# Altium schematic sheet HIGH_CURR_MOS2.SchDoc
size A4; SheetNumber: 6; SheetTotal: 14
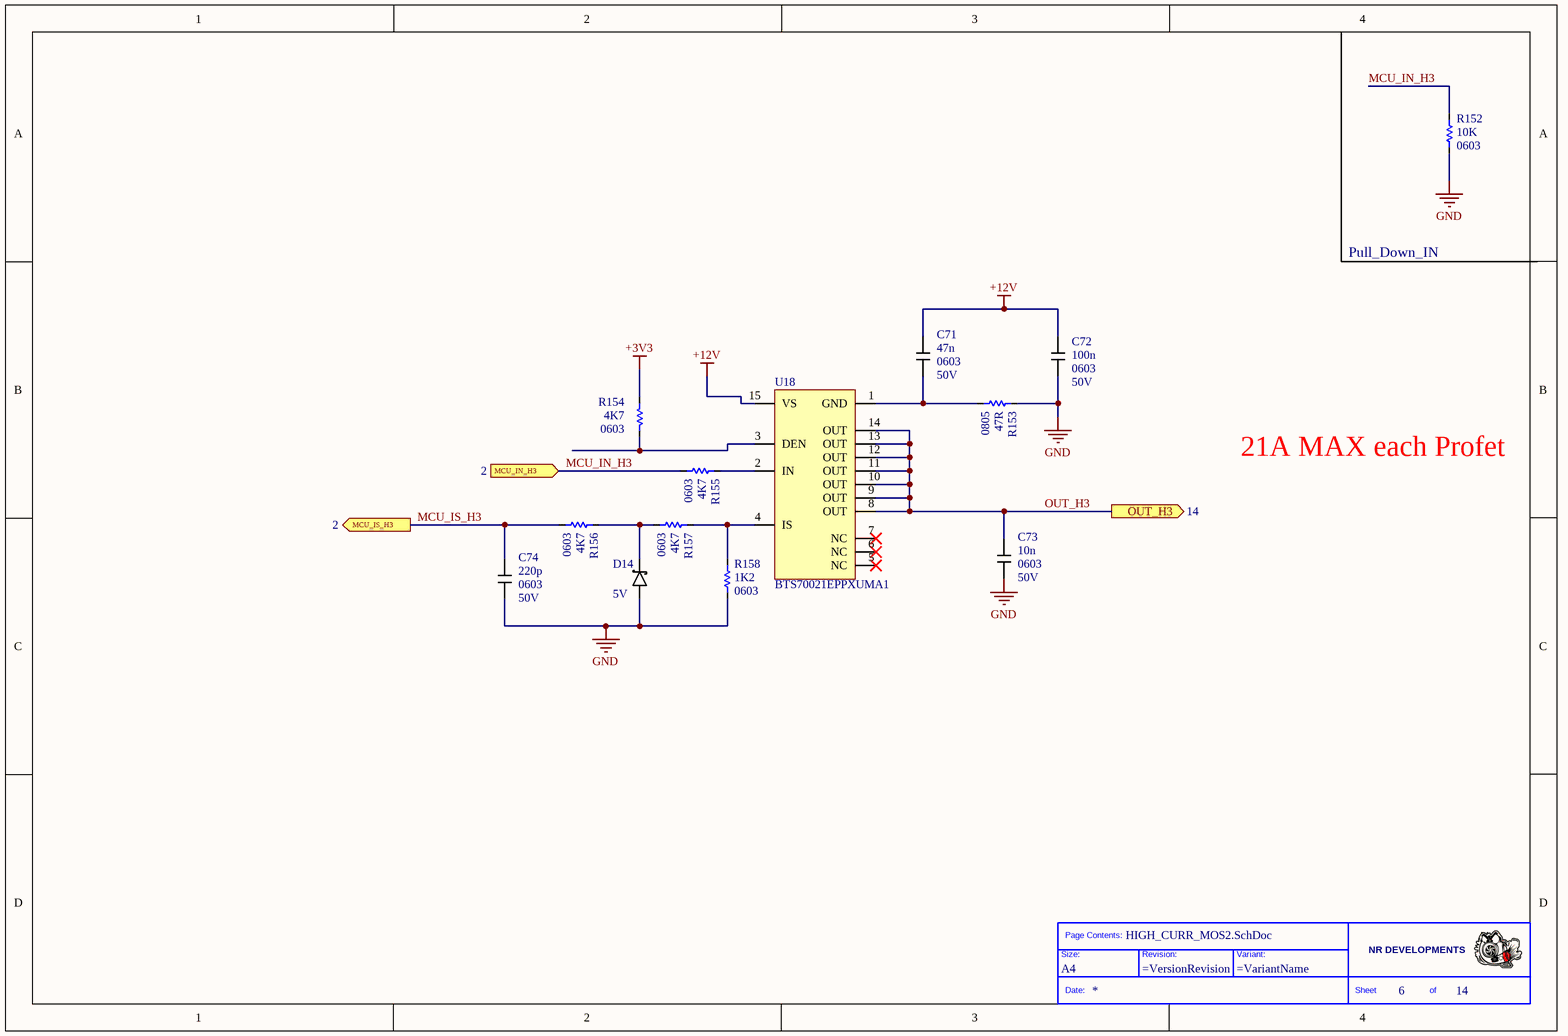
[diagram p0: HIGH_CURR_MOS2.SchDoc]

## Parts
*  Size: A4  (hidden comment: Title_Block)  (graphical)
C71  value 47n  Case: 0603  Voltage: 50V  [CAPC1608X09M]  (hidden comment: CAP)
C72  value 100n  Case: 0603  Voltage: 50V  [CAPC1608X09M]  (hidden comment: CAP)
C73  value 10n  Case: 0603  Voltage: 50V  [CAPC1608X09M]  (hidden comment: CAP)
C74  value 220p  Case: 0603  Voltage: 50V  [CAPC1608X09M]  (hidden comment: CAP)
D14  value 5V  [SOT65P210X100-3N - AC]  (hidden comment: Diode_Schottky)
R152  value 10K  Case: 0603  [RESC1608X06M]  (hidden comment: Res)
R153  value 47R  Case: 0805  [RESC2012X06N]  (hidden comment: Res)
R154  value 4K7  Case: 0603  [RESC1608X06M]  (hidden comment: Res)
R155  value 4K7  Case: 0603  [RESC1608X06M]  (hidden comment: Res)
R156  value 4K7  Case: 0603  [RESC1608X06M]  (hidden comment: Res)
R157  value 4K7  Case: 0603  [RESC1608X06M]  (hidden comment: Res)
R158  value 1K2  Case: 0603  [RESC1608X06M]  (hidden comment: Res)
U18  value BTS70021EPPXUMA1  [SOP65P600X115-15]  (hidden comment: BTS7002-1EPP)

## Ports
MCU_IN_H3 (in, see 2), MCU_IS_H3 (out, see 2), OUT_H3 (out, see 14)

## Nets
+3V3: R154.2
+12V: C71.1 C72.1 U18.15(VS)
GND: C72.2 C73.2 C74.2 D14.A R152.1 R153.2 R158.1
MCU_IN_H3: R152.2 R155.1 ; port MCU_IN_H3
MCU_IS_H3: C74.1 R156.1 ; port MCU_IS_H3
OUT_H3: C73.1 U18.8(OUT) U18.9(OUT) U18.10(OUT) U18.11(OUT) U18.12(OUT) U18.13(OUT) U18.14(OUT) ; port OUT_H3
NetC71_2: C71.2 R153.1 U18.1(GND)
NetD14_C: D14.C R156.2 R157.1
NetR154_1: R154.1 U18.3(DEN)
NetR155_2: R155.2 U18.2(IN)
NetR157_2: R157.2 R158.2 U18.4(IS)

Not connected (* = marked no-connect by the designer): U18 5(NC)* 6(NC)* 7(NC)*

## Notes on the sheet
- Pull_Down_IN
- 21A MAX each Profet
- (in symbol Title_Block) Page Contents:; NR DEVELOPMENTS; Size:; Revision:; Variant:; Date:; Sheet; of

## Library data of the parts
C71 = CAP: Manufacturer: KEMET; PartNumber: C0603C473M5RACTU
C72 = CAP: Manufacturer: KEMET; PartNumber: C0603C104K5RACTU
C73 = CAP: Manufacturer: KEMET; PartNumber: C0603C103M5RACTM
C74 = CAP: Manufacturer: KEMET; PartNumber: C0603C221J5RACTU
D14 = Diode_Schottky: Manufacturer: Nexperia; PartNumber: BZX84W-C4V7-QX; Case: SOT-323-3
R152 = Resistor: Manufacturer: YAGEO; PartNumber: AC0603FR-0710KL
R153 = Resistor: Manufacturer: Vishay; PartNumber: CRCW080547R0FKEA
R154-R157 = Resistor: Manufacturer: YAGEO; PartNumber: RC0603FR-074K7L
R158 = Resistor: Manufacturer: Vishay; PartNumber: CRCW06031K20FKEA
U18 = BTS7002-1EPP: Smart High-Side Power Switch 21A; Manufacturer: Infineon Technologies; PartNumber: BTS70021EPPXUMA1; Case: TSDSO-14